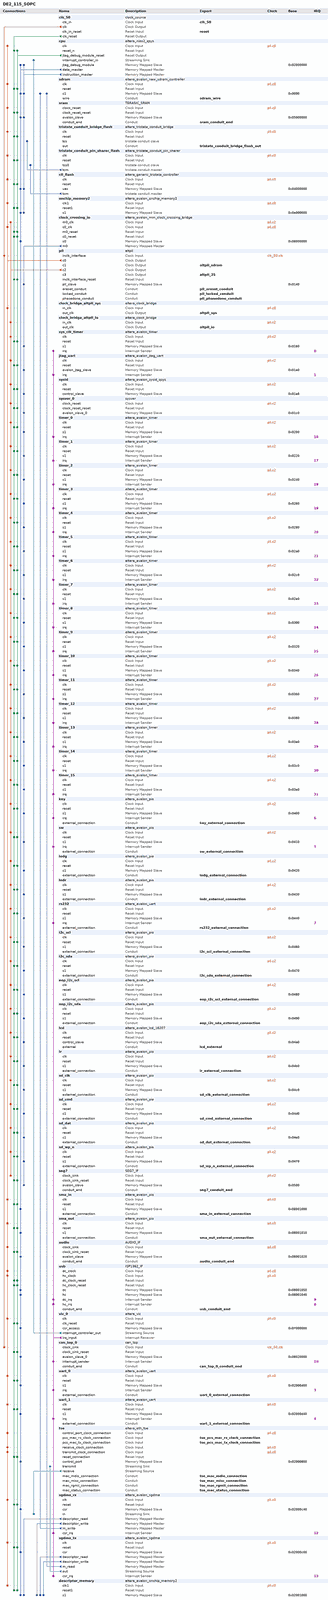
[diagram p0: system contents, whole]
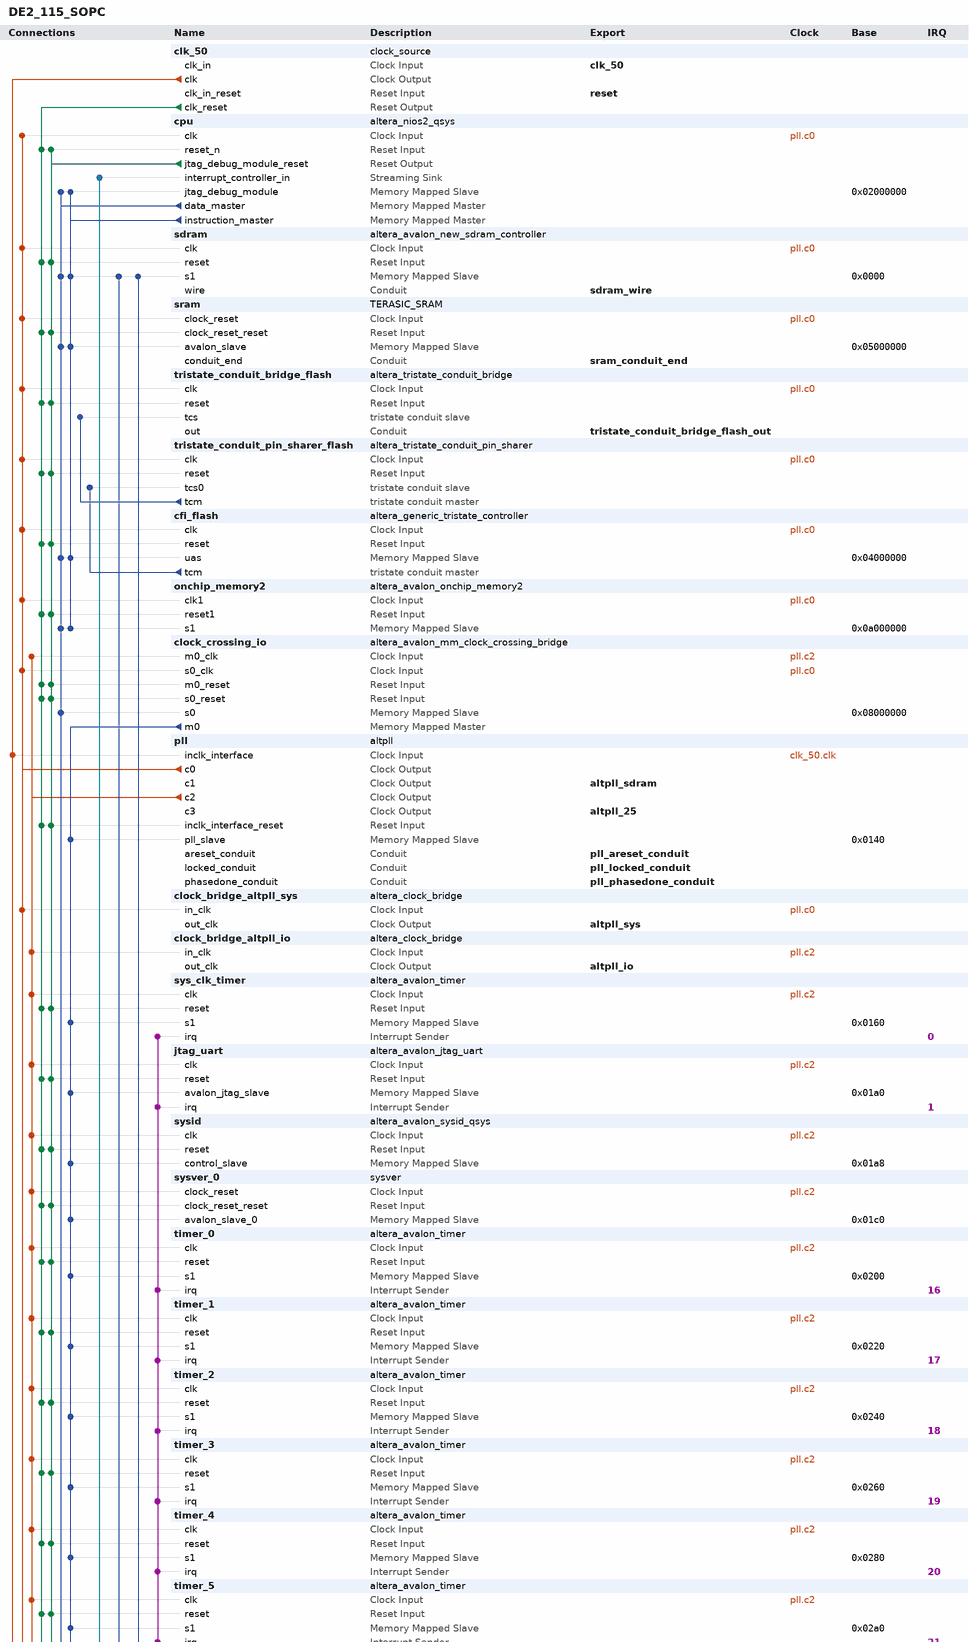
[diagram p1: system contents, upper part]
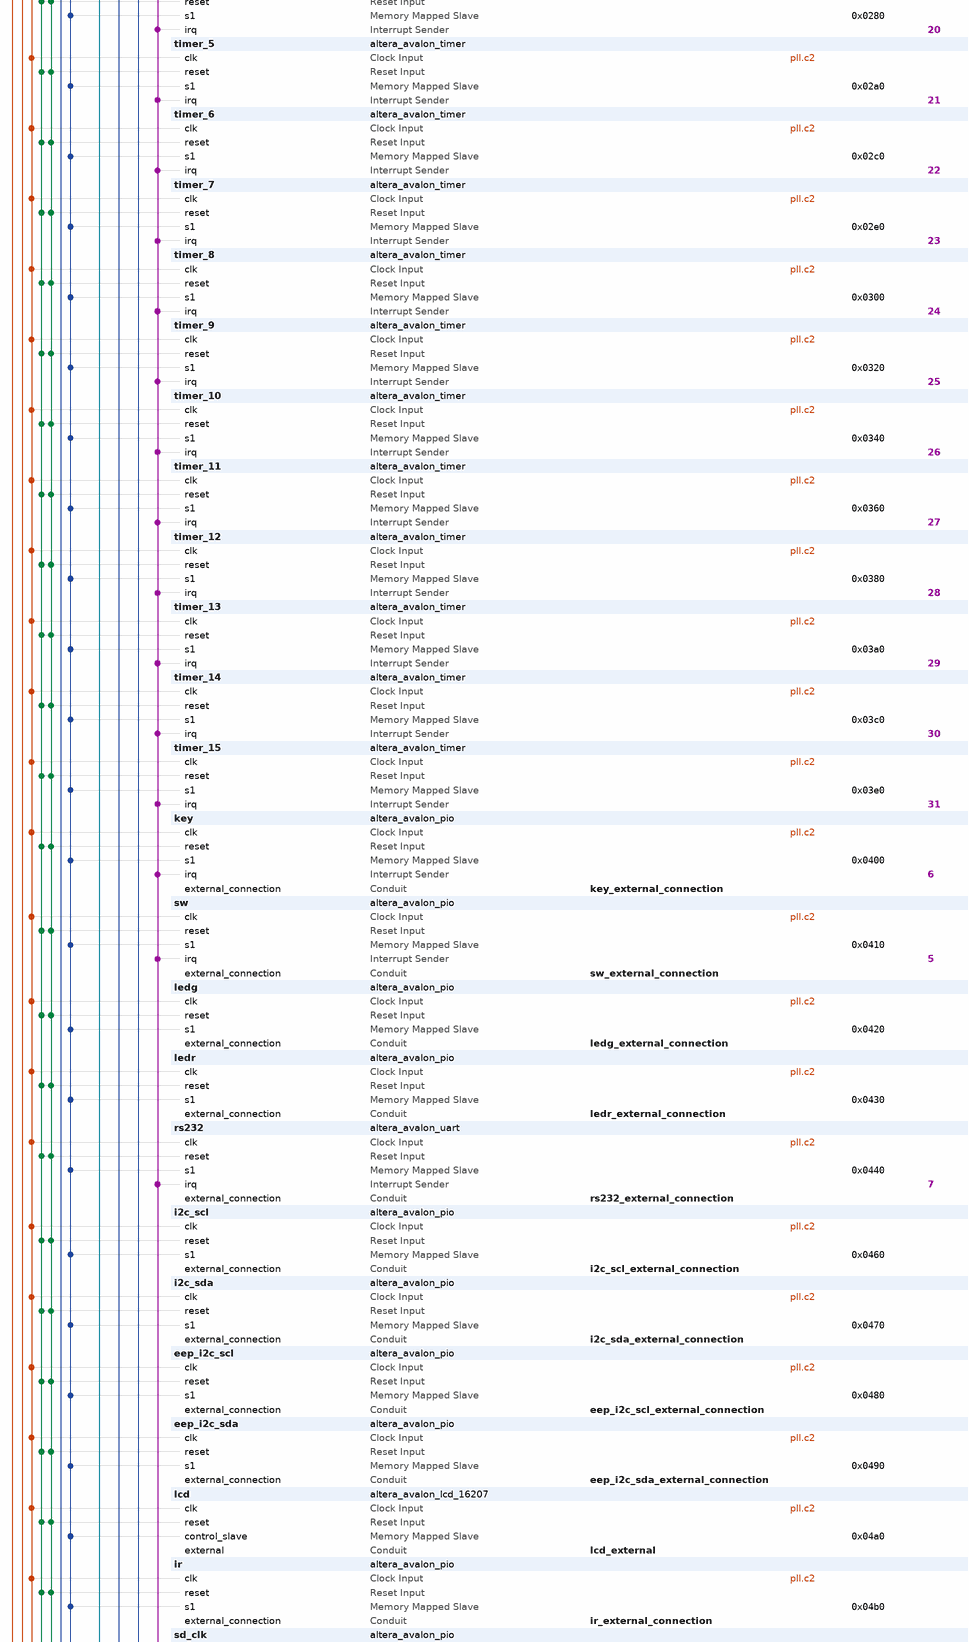
[diagram p2: system contents, middle part]
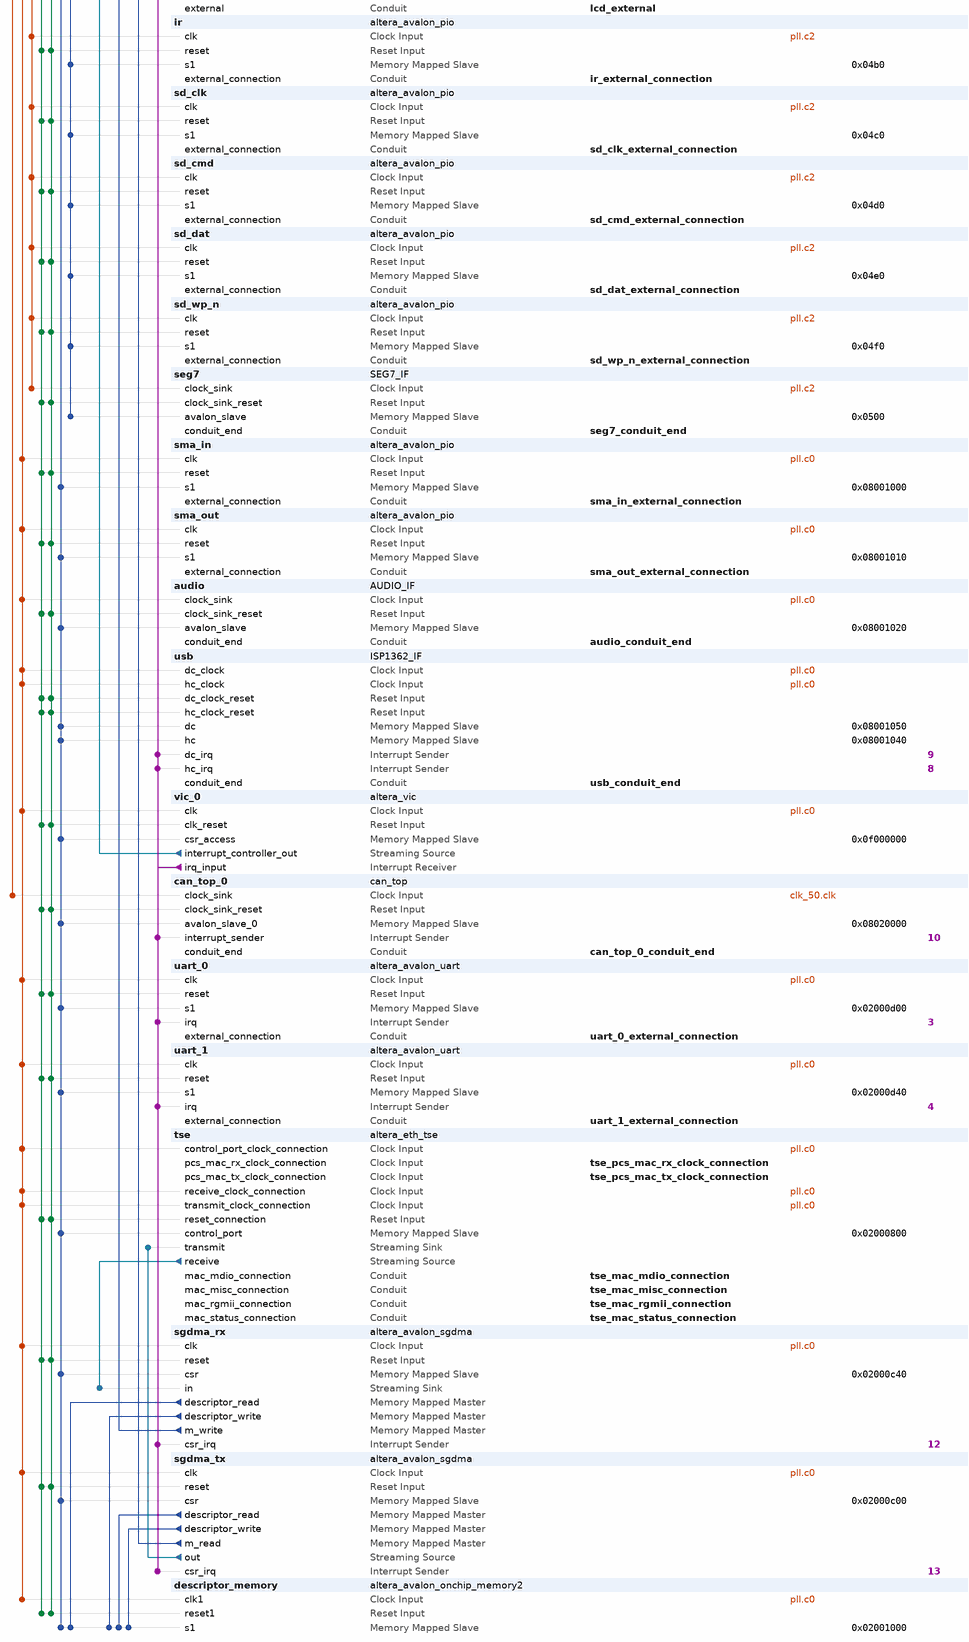
[diagram p3: system contents, lower part]
# Platform Designer (Qsys) system DE2_115_SOPC, Cyclone IV E EP4CE115F29C7
# Parameters at their usual value, and those the tool derives, are not listed.
package require -exact qsys 13.1
create_system DE2_115_SOPC
set_project_property DEVICE_FAMILY {Cyclone IV E}
set_project_property DEVICE EP4CE115F29C7

add_instance clk_50 clock_source 13.1
set_instance_parameter_value clk_50 clockFrequency 50000000

add_instance cpu altera_nios2_qsys 13.1
set_instance_parameter_value cpu setting_preciseDivisionErrorException true
set_instance_parameter_value cpu muldiv_divider true
set_instance_parameter_value cpu mpu_useLimit true
set_instance_parameter_value cpu mpu_enabled true
set_instance_parameter_value cpu manuallyAssignCpuID false
set_instance_parameter_value cpu mpu_numOfInstRegion 16
set_instance_parameter_value cpu mpu_numOfDataRegion 16
set_instance_parameter_value cpu resetSlave sram.avalon_slave
set_instance_parameter_value cpu exceptionSlave sdram.s1
set_instance_parameter_value cpu breakSlave cpu.jtag_debug_module
set_instance_parameter_value cpu setting_interruptControllerType External
set_instance_parameter_value cpu mpu_minInstRegionSize 6
set_instance_parameter_value cpu mpu_minDataRegionSize 6
set_instance_parameter_value cpu impl Fast
set_instance_parameter_value cpu icache_size 4096
set_instance_parameter_value cpu icache_burstType Sequential
set_instance_parameter_value cpu debug_level Level3
set_instance_parameter_value cpu dcache_size 0

add_instance sdram altera_avalon_new_sdram_controller 13.1
set_instance_parameter_value sdram TAC 5.5
set_instance_parameter_value sdram TRCD 20.0
set_instance_parameter_value sdram TRP 20.0
set_instance_parameter_value sdram casLatency 3
set_instance_parameter_value sdram columnWidth 10
set_instance_parameter_value sdram dataWidth 32
set_instance_parameter_value sdram generateSimulationModel true
set_instance_parameter_value sdram model custom
set_instance_parameter_value sdram numberOfBanks 4
set_instance_parameter_value sdram numberOfChipSelects 1
set_instance_parameter_value sdram powerUpDelay 100.0
set_instance_parameter_value sdram refreshPeriod 15.625
set_instance_parameter_value sdram rowWidth 11

add_instance sram TERASIC_SRAM 1.0
set_instance_parameter_value sram DATA_BITS 16
set_instance_parameter_value sram ADDR_BITS 20

add_instance tristate_conduit_bridge_flash altera_tristate_conduit_bridge 13.1

add_instance tristate_conduit_pin_sharer_flash altera_tristate_conduit_pin_sharer 13.1
set_instance_parameter_value tristate_conduit_pin_sharer_flash NUM_INTERFACES 1
set_instance_parameter_value tristate_conduit_pin_sharer_flash MODULE_ORIGIN_LIST cfi_flash.tcm,cfi_flash.tcm,cfi_flash.tcm,cfi_flash.tcm,cfi_flash.tcm
set_instance_parameter_value tristate_conduit_pin_sharer_flash SHARED_SIGNAL_LIST address_to_the_cfi_flash,read_n_to_the_cfi_flash,write_n_to_the_cfi_flash,tri_state_bridge_flash_data,select_n_to_the_cfi_flash

add_instance cfi_flash altera_generic_tristate_controller 13.1
set_instance_parameter_value cfi_flash TCM_ADDRESS_W 23
set_instance_parameter_value cfi_flash TCM_DATA_W 8
set_instance_parameter_value cfi_flash TCM_BYTEENABLE_W 1
set_instance_parameter_value cfi_flash TCM_READ_WAIT 160
set_instance_parameter_value cfi_flash TCM_WRITE_WAIT 160
set_instance_parameter_value cfi_flash TCM_SETUP_WAIT 60
set_instance_parameter_value cfi_flash TCM_DATA_HOLD 60
set_instance_parameter_value cfi_flash TCM_MAX_PENDING_READ_TRANSACTIONS 3
set_instance_parameter_value cfi_flash TCM_TURNAROUND_TIME 2
set_instance_parameter_value cfi_flash TCM_TIMING_UNITS 0
set_instance_parameter_value cfi_flash TCM_READLATENCY 2
set_instance_parameter_value cfi_flash TCM_SYMBOLS_PER_WORD 1
set_instance_parameter_value cfi_flash USE_READ 1
set_instance_parameter_value cfi_flash USE_BEGINTRANSFER 0
set_instance_parameter_value cfi_flash USE_BYTEENABLE 0
set_instance_parameter_value cfi_flash USE_OUTPUTENABLE 0
set_instance_parameter_value cfi_flash ACTIVE_LOW_READ 1
set_instance_parameter_value cfi_flash ACTIVE_LOW_BYTEENABLE 0
set_instance_parameter_value cfi_flash ACTIVE_LOW_OUTPUTENABLE 0
set_instance_parameter_value cfi_flash ACTIVE_LOW_BEGINTRANSFER 0
set_instance_parameter_value cfi_flash CHIPSELECT_THROUGH_READLATENCY 0
set_instance_parameter_value cfi_flash MODULE_ASSIGNMENT_KEYS embeddedsw.configuration.hwClassnameDriverSupportList,embeddedsw.configuration.hwClassnameDriverSupportDefault,embeddedsw.CMacro.SETUP_VALUE,embeddedsw.CMacro.WAIT_VALUE,embeddedsw.CMacro.HOLD_VALUE,embeddedsw.CMacro.TIMING_UNITS,embeddedsw.CMacro.SIZE,embeddedsw.memoryInfo.MEM_INIT_DATA_WIDTH,embeddedsw.memoryInfo.HAS_BYTE_LANE,embeddedsw.memoryInfo.IS_FLASH,embeddedsw.memoryInfo.GENERATE_DAT_SYM,embeddedsw.memoryInfo.GENERATE_FLASH,embeddedsw.memoryInfo.DAT_SYM_INSTALL_DIR,embeddedsw.memoryInfo.FLASH_INSTALL_DIR
set_instance_parameter_value cfi_flash MODULE_ASSIGNMENT_VALUES {altera_avalon_lan91c111:altera_avalon_cfi_flash,altera_avalon_cfi_flash,60,160,60,"ns",8388608u,8,0,1,1,1,SIM_DIR,APP_DIR}
set_instance_parameter_value cfi_flash INTERFACE_ASSIGNMENT_KEYS embeddedsw.configuration.isFlash,embeddedsw.configuration.isMemoryDevice,embeddedsw.configuration.isNonVolatileStorage
set_instance_parameter_value cfi_flash INTERFACE_ASSIGNMENT_VALUES 1,1,1

add_instance onchip_memory2 altera_avalon_onchip_memory2 13.1
set_instance_parameter_value onchip_memory2 dataWidth 32
set_instance_parameter_value onchip_memory2 dualPort false
set_instance_parameter_value onchip_memory2 initMemContent true
set_instance_parameter_value onchip_memory2 initializationFileName onchip_memory2
set_instance_parameter_value onchip_memory2 memorySize 131072

add_instance clock_crossing_io altera_avalon_mm_clock_crossing_bridge 13.1
set_instance_parameter_value clock_crossing_io DATA_WIDTH 32
set_instance_parameter_value clock_crossing_io ADDRESS_WIDTH 11
set_instance_parameter_value clock_crossing_io MAX_BURST_SIZE 1
set_instance_parameter_value clock_crossing_io COMMAND_FIFO_DEPTH 32
set_instance_parameter_value clock_crossing_io RESPONSE_FIFO_DEPTH 256
set_instance_parameter_value clock_crossing_io MASTER_SYNC_DEPTH 3
set_instance_parameter_value clock_crossing_io SLAVE_SYNC_DEPTH 3

add_instance pll altpll 13.1
set_instance_parameter_value pll INCLK0_INPUT_FREQUENCY 20000
set_instance_parameter_value pll CLK0_MULTIPLY_BY 2
set_instance_parameter_value pll CLK1_MULTIPLY_BY 2
set_instance_parameter_value pll CLK2_MULTIPLY_BY 6
set_instance_parameter_value pll CLK3_MULTIPLY_BY 1
set_instance_parameter_value pll CLK0_DIVIDE_BY 1
set_instance_parameter_value pll CLK1_DIVIDE_BY 1
set_instance_parameter_value pll CLK2_DIVIDE_BY 5
set_instance_parameter_value pll CLK3_DIVIDE_BY 2
set_instance_parameter_value pll CLK1_PHASE_SHIFT -1806
set_instance_parameter_value pll CLK2_PHASE_SHIFT 0
set_instance_parameter_value pll CLK3_PHASE_SHIFT 0
set_instance_parameter_value pll CLK1_DUTY_CYCLE 50
set_instance_parameter_value pll CLK2_DUTY_CYCLE 50
set_instance_parameter_value pll CLK3_DUTY_CYCLE 50
set_instance_parameter_value pll PORT_clk1 PORT_USED
set_instance_parameter_value pll PORT_clk2 PORT_USED
set_instance_parameter_value pll PORT_clk3 PORT_USED
set_instance_parameter_value pll PORT_ARESET PORT_USED
set_instance_parameter_value pll PORT_LOCKED PORT_USED

add_instance clock_bridge_altpll_sys altera_clock_bridge 13.1
set_instance_parameter_value clock_bridge_altpll_sys DERIVED_CLOCK_RATE 100000000
set_instance_parameter_value clock_bridge_altpll_sys EXPLICIT_CLOCK_RATE 0

add_instance clock_bridge_altpll_io altera_clock_bridge 13.1
set_instance_parameter_value clock_bridge_altpll_io DERIVED_CLOCK_RATE 60000000
set_instance_parameter_value clock_bridge_altpll_io EXPLICIT_CLOCK_RATE 0

add_instance sys_clk_timer altera_avalon_timer 13.1
set_instance_parameter_value sys_clk_timer period 1
set_instance_parameter_value sys_clk_timer periodUnits MSEC

add_instance jtag_uart altera_avalon_jtag_uart 13.1
set_instance_parameter_value jtag_uart simInteractiveOptions INTERACTIVE_ASCII_OUTPUT

add_instance sysid altera_avalon_sysid_qsys 13.1
set_instance_parameter_value sysid id 0

add_instance sysver_0 sysver 1.0
set_instance_parameter_value sysver_0 VER1_ROM_REG_VALUE 7
set_instance_parameter_value sysver_0 VER2_ROM_REG_VALUE 0
set_instance_parameter_value sysver_0 VER3_ROM_REG_VALUE 1
set_instance_parameter_value sysver_0 VER4_ROM_REG_VALUE 0
set_instance_parameter_value sysver_0 VER5_RAM_REG_VALUE 0
set_instance_parameter_value sysver_0 VER6_RAM_REG_VALUE 0
set_instance_parameter_value sysver_0 VER7_RAM_REG_VALUE 0
set_instance_parameter_value sysver_0 VER8_RAM_REG_VALUE 0

add_instance timer_0 altera_avalon_timer 13.1
set_instance_parameter_value timer_0 period 1
set_instance_parameter_value timer_0 periodUnits MSEC

add_instance timer_1 altera_avalon_timer 13.1
set_instance_parameter_value timer_1 period 1
set_instance_parameter_value timer_1 periodUnits MSEC

add_instance timer_2 altera_avalon_timer 13.1
set_instance_parameter_value timer_2 period 1
set_instance_parameter_value timer_2 periodUnits MSEC

add_instance timer_3 altera_avalon_timer 13.1
set_instance_parameter_value timer_3 period 1
set_instance_parameter_value timer_3 periodUnits MSEC

add_instance timer_4 altera_avalon_timer 13.1
set_instance_parameter_value timer_4 period 1
set_instance_parameter_value timer_4 periodUnits MSEC

add_instance timer_5 altera_avalon_timer 13.1
set_instance_parameter_value timer_5 period 1
set_instance_parameter_value timer_5 periodUnits MSEC

add_instance timer_6 altera_avalon_timer 13.1
set_instance_parameter_value timer_6 period 1
set_instance_parameter_value timer_6 periodUnits MSEC

add_instance timer_7 altera_avalon_timer 13.1
set_instance_parameter_value timer_7 period 1
set_instance_parameter_value timer_7 periodUnits MSEC

add_instance timer_8 altera_avalon_timer 13.1
set_instance_parameter_value timer_8 period 1
set_instance_parameter_value timer_8 periodUnits MSEC

add_instance timer_9 altera_avalon_timer 13.1
set_instance_parameter_value timer_9 period 1
set_instance_parameter_value timer_9 periodUnits MSEC

add_instance timer_10 altera_avalon_timer 13.1
set_instance_parameter_value timer_10 period 1
set_instance_parameter_value timer_10 periodUnits MSEC

add_instance timer_11 altera_avalon_timer 13.1
set_instance_parameter_value timer_11 period 1
set_instance_parameter_value timer_11 periodUnits MSEC

add_instance timer_12 altera_avalon_timer 13.1
set_instance_parameter_value timer_12 period 1
set_instance_parameter_value timer_12 periodUnits MSEC

add_instance timer_13 altera_avalon_timer 13.1
set_instance_parameter_value timer_13 period 1
set_instance_parameter_value timer_13 periodUnits MSEC

add_instance timer_14 altera_avalon_timer 13.1
set_instance_parameter_value timer_14 period 1
set_instance_parameter_value timer_14 periodUnits MSEC

add_instance timer_15 altera_avalon_timer 13.1
set_instance_parameter_value timer_15 period 1
set_instance_parameter_value timer_15 periodUnits MSEC

add_instance key altera_avalon_pio 13.1
set_instance_parameter_value key captureEdge true
set_instance_parameter_value key direction Input
set_instance_parameter_value key edgeType FALLING
set_instance_parameter_value key generateIRQ true
set_instance_parameter_value key irqType EDGE
set_instance_parameter_value key width 4

add_instance sw altera_avalon_pio 13.1
set_instance_parameter_value sw captureEdge true
set_instance_parameter_value sw direction Input
set_instance_parameter_value sw edgeType FALLING
set_instance_parameter_value sw generateIRQ true
set_instance_parameter_value sw irqType EDGE
set_instance_parameter_value sw width 18

add_instance ledg altera_avalon_pio 13.1
set_instance_parameter_value ledg direction Output
set_instance_parameter_value ledg width 9

add_instance ledr altera_avalon_pio 13.1
set_instance_parameter_value ledr direction Output
set_instance_parameter_value ledr width 18

add_instance rs232 altera_avalon_uart 13.1
set_instance_parameter_value rs232 baud 115200
set_instance_parameter_value rs232 dataBits 8
set_instance_parameter_value rs232 fixedBaud true
set_instance_parameter_value rs232 parity NONE
set_instance_parameter_value rs232 stopBits 1
set_instance_parameter_value rs232 useCtsRts true

add_instance i2c_scl altera_avalon_pio 13.1
set_instance_parameter_value i2c_scl direction Output
set_instance_parameter_value i2c_scl width 1

add_instance i2c_sda altera_avalon_pio 13.1
set_instance_parameter_value i2c_sda direction Bidir
set_instance_parameter_value i2c_sda width 1

add_instance eep_i2c_scl altera_avalon_pio 13.1
set_instance_parameter_value eep_i2c_scl direction Output
set_instance_parameter_value eep_i2c_scl width 1

add_instance eep_i2c_sda altera_avalon_pio 13.1
set_instance_parameter_value eep_i2c_sda direction Bidir
set_instance_parameter_value eep_i2c_sda width 1

add_instance lcd altera_avalon_lcd_16207 13.1

add_instance ir altera_avalon_pio 13.1
set_instance_parameter_value ir direction Input
set_instance_parameter_value ir width 1

add_instance sd_clk altera_avalon_pio 13.1
set_instance_parameter_value sd_clk direction Output
set_instance_parameter_value sd_clk width 1

add_instance sd_cmd altera_avalon_pio 13.1
set_instance_parameter_value sd_cmd direction Bidir
set_instance_parameter_value sd_cmd width 1

add_instance sd_dat altera_avalon_pio 13.1
set_instance_parameter_value sd_dat direction Bidir
set_instance_parameter_value sd_dat width 4

add_instance sd_wp_n altera_avalon_pio 13.1
set_instance_parameter_value sd_wp_n direction Input
set_instance_parameter_value sd_wp_n width 1

add_instance seg7 SEG7_IF 1.0
set_instance_parameter_value seg7 SEG7_NUM 8

add_instance sma_in altera_avalon_pio 13.1
set_instance_parameter_value sma_in direction Input
set_instance_parameter_value sma_in width 1

add_instance sma_out altera_avalon_pio 13.1
set_instance_parameter_value sma_out direction Output
set_instance_parameter_value sma_out width 1

add_instance audio AUDIO_IF 1.0

add_instance usb ISP1362_IF 1.0

add_instance vic_0 altera_vic 13.1
set_instance_parameter_value vic_0 NUMBER_OF_INT_PORTS 32
set_instance_parameter_value vic_0 RIL_WIDTH 6
set_instance_parameter_value vic_0 DAISY_CHAIN_ENABLE 0

add_instance can_top_0 can_top 2.5
set_instance_parameter_value can_top_0 Tp 1

add_instance uart_0 altera_avalon_uart 13.1
set_instance_parameter_value uart_0 baud 115200
set_instance_parameter_value uart_0 dataBits 8
set_instance_parameter_value uart_0 fixedBaud false
set_instance_parameter_value uart_0 parity NONE
set_instance_parameter_value uart_0 stopBits 1

add_instance uart_1 altera_avalon_uart 13.1
set_instance_parameter_value uart_1 baud 115200
set_instance_parameter_value uart_1 dataBits 8
set_instance_parameter_value uart_1 fixedBaud false
set_instance_parameter_value uart_1 parity NONE
set_instance_parameter_value uart_1 stopBits 1

add_instance tse altera_eth_tse 13.1
set_instance_parameter_value tse core_variation MAC_ONLY
set_instance_parameter_value tse ifGMII RGMII
set_instance_parameter_value tse transceiver_type NONE
set_instance_parameter_value tse enable_hd_logic true
set_instance_parameter_value tse stat_cnt_ena true
set_instance_parameter_value tse enable_shift16 true
set_instance_parameter_value tse enable_mac_flow_ctrl false
set_instance_parameter_value tse enable_magic_detect false
set_instance_parameter_value tse mdio_clk_div 40
set_instance_parameter_value tse ing_addr 11

add_instance sgdma_rx altera_avalon_sgdma 13.1
set_instance_parameter_value sgdma_rx enableBurstTransfers false
set_instance_parameter_value sgdma_rx enableUnalignedTransfers false
set_instance_parameter_value sgdma_rx readBlockDataWidth 32
set_instance_parameter_value sgdma_rx sinkErrorWidth 6
set_instance_parameter_value sgdma_rx sourceErrorWidth 0
set_instance_parameter_value sgdma_rx transferMode STREAM_TO_MEMORY
set_instance_parameter_value sgdma_rx writeBurstcountWidth 4

add_instance sgdma_tx altera_avalon_sgdma 13.1
set_instance_parameter_value sgdma_tx enableBurstTransfers false
set_instance_parameter_value sgdma_tx enableUnalignedTransfers false
set_instance_parameter_value sgdma_tx readBlockDataWidth 32
set_instance_parameter_value sgdma_tx sinkErrorWidth 0
set_instance_parameter_value sgdma_tx sourceErrorWidth 1
set_instance_parameter_value sgdma_tx transferMode MEMORY_TO_STREAM
set_instance_parameter_value sgdma_tx writeBurstcountWidth 4

add_instance descriptor_memory altera_avalon_onchip_memory2 13.1
set_instance_parameter_value descriptor_memory dataWidth 32
set_instance_parameter_value descriptor_memory dualPort false
set_instance_parameter_value descriptor_memory initMemContent true
set_instance_parameter_value descriptor_memory initializationFileName onchip_mem.hex
set_instance_parameter_value descriptor_memory memorySize 4096

# connections
add_connection clk_50.clk can_top_0.clock_sink clock
add_connection clk_50.clk pll.inclk_interface clock
add_connection pll.c0 audio.clock_sink clock
add_connection pll.c0 cfi_flash.clk clock
add_connection pll.c0 clock_bridge_altpll_sys.in_clk clock
add_connection pll.c0 clock_crossing_io.s0_clk clock
add_connection pll.c0 cpu.clk clock
add_connection pll.c0 descriptor_memory.clk1 clock
add_connection pll.c0 onchip_memory2.clk1 clock
add_connection pll.c0 sdram.clk clock
add_connection pll.c0 sgdma_rx.clk clock
add_connection pll.c0 sgdma_tx.clk clock
add_connection pll.c0 sma_in.clk clock
add_connection pll.c0 sma_out.clk clock
add_connection pll.c0 sram.clock_reset clock
add_connection pll.c0 tristate_conduit_bridge_flash.clk clock
add_connection pll.c0 tristate_conduit_pin_sharer_flash.clk clock
add_connection pll.c0 tse.control_port_clock_connection clock
add_connection pll.c0 tse.receive_clock_connection clock
add_connection pll.c0 tse.transmit_clock_connection clock
add_connection pll.c0 uart_0.clk clock
add_connection pll.c0 uart_1.clk clock
add_connection pll.c0 usb.dc_clock clock
add_connection pll.c0 usb.hc_clock clock
add_connection pll.c0 vic_0.clk clock
add_connection pll.c2 clock_bridge_altpll_io.in_clk clock
add_connection pll.c2 clock_crossing_io.m0_clk clock
add_connection pll.c2 eep_i2c_scl.clk clock
add_connection pll.c2 eep_i2c_sda.clk clock
add_connection pll.c2 i2c_scl.clk clock
add_connection pll.c2 i2c_sda.clk clock
add_connection pll.c2 ir.clk clock
add_connection pll.c2 jtag_uart.clk clock
add_connection pll.c2 key.clk clock
add_connection pll.c2 lcd.clk clock
add_connection pll.c2 ledg.clk clock
add_connection pll.c2 ledr.clk clock
add_connection pll.c2 rs232.clk clock
add_connection pll.c2 sd_clk.clk clock
add_connection pll.c2 sd_cmd.clk clock
add_connection pll.c2 sd_dat.clk clock
add_connection pll.c2 sd_wp_n.clk clock
add_connection pll.c2 seg7.clock_sink clock
add_connection pll.c2 sw.clk clock
add_connection pll.c2 sys_clk_timer.clk clock
add_connection pll.c2 sysid.clk clock
add_connection pll.c2 sysver_0.clock_reset clock
add_connection pll.c2 timer_0.clk clock
add_connection pll.c2 timer_1.clk clock
add_connection pll.c2 timer_2.clk clock
add_connection pll.c2 timer_3.clk clock
add_connection pll.c2 timer_4.clk clock
add_connection pll.c2 timer_5.clk clock
add_connection pll.c2 timer_6.clk clock
add_connection pll.c2 timer_7.clk clock
add_connection pll.c2 timer_8.clk clock
add_connection pll.c2 timer_9.clk clock
add_connection pll.c2 timer_10.clk clock
add_connection pll.c2 timer_11.clk clock
add_connection pll.c2 timer_12.clk clock
add_connection pll.c2 timer_13.clk clock
add_connection pll.c2 timer_14.clk clock
add_connection pll.c2 timer_15.clk clock
add_connection clk_50.clk_reset audio.clock_sink_reset reset
add_connection clk_50.clk_reset can_top_0.clock_sink_reset reset
add_connection clk_50.clk_reset cfi_flash.reset reset
add_connection clk_50.clk_reset clock_crossing_io.m0_reset reset
add_connection clk_50.clk_reset clock_crossing_io.s0_reset reset
add_connection clk_50.clk_reset cpu.reset_n reset
add_connection clk_50.clk_reset descriptor_memory.reset1 reset
add_connection clk_50.clk_reset eep_i2c_scl.reset reset
add_connection clk_50.clk_reset eep_i2c_sda.reset reset
add_connection clk_50.clk_reset i2c_scl.reset reset
add_connection clk_50.clk_reset i2c_sda.reset reset
add_connection clk_50.clk_reset ir.reset reset
add_connection clk_50.clk_reset jtag_uart.reset reset
add_connection clk_50.clk_reset key.reset reset
add_connection clk_50.clk_reset lcd.reset reset
add_connection clk_50.clk_reset ledg.reset reset
add_connection clk_50.clk_reset ledr.reset reset
add_connection clk_50.clk_reset onchip_memory2.reset1 reset
add_connection clk_50.clk_reset pll.inclk_interface_reset reset
add_connection clk_50.clk_reset rs232.reset reset
add_connection clk_50.clk_reset sd_clk.reset reset
add_connection clk_50.clk_reset sd_cmd.reset reset
add_connection clk_50.clk_reset sd_dat.reset reset
add_connection clk_50.clk_reset sd_wp_n.reset reset
add_connection clk_50.clk_reset sdram.reset reset
add_connection clk_50.clk_reset seg7.clock_sink_reset reset
add_connection clk_50.clk_reset sgdma_rx.reset reset
add_connection clk_50.clk_reset sgdma_tx.reset reset
add_connection clk_50.clk_reset sma_in.reset reset
add_connection clk_50.clk_reset sma_out.reset reset
add_connection clk_50.clk_reset sram.clock_reset_reset reset
add_connection clk_50.clk_reset sw.reset reset
add_connection clk_50.clk_reset sys_clk_timer.reset reset
add_connection clk_50.clk_reset sysid.reset reset
add_connection clk_50.clk_reset sysver_0.clock_reset_reset reset
add_connection clk_50.clk_reset timer_0.reset reset
add_connection clk_50.clk_reset timer_1.reset reset
add_connection clk_50.clk_reset timer_2.reset reset
add_connection clk_50.clk_reset timer_3.reset reset
add_connection clk_50.clk_reset timer_4.reset reset
add_connection clk_50.clk_reset timer_5.reset reset
add_connection clk_50.clk_reset timer_6.reset reset
add_connection clk_50.clk_reset timer_7.reset reset
add_connection clk_50.clk_reset timer_8.reset reset
add_connection clk_50.clk_reset timer_9.reset reset
add_connection clk_50.clk_reset timer_10.reset reset
add_connection clk_50.clk_reset timer_11.reset reset
add_connection clk_50.clk_reset timer_12.reset reset
add_connection clk_50.clk_reset timer_13.reset reset
add_connection clk_50.clk_reset timer_14.reset reset
add_connection clk_50.clk_reset timer_15.reset reset
add_connection clk_50.clk_reset tristate_conduit_bridge_flash.reset reset
add_connection clk_50.clk_reset tristate_conduit_pin_sharer_flash.reset reset
add_connection clk_50.clk_reset tse.reset_connection reset
add_connection clk_50.clk_reset uart_0.reset reset
add_connection clk_50.clk_reset uart_1.reset reset
add_connection clk_50.clk_reset usb.dc_clock_reset reset
add_connection clk_50.clk_reset usb.hc_clock_reset reset
add_connection clk_50.clk_reset vic_0.clk_reset reset
add_connection cpu.jtag_debug_module_reset audio.clock_sink_reset reset
add_connection cpu.jtag_debug_module_reset can_top_0.clock_sink_reset reset
add_connection cpu.jtag_debug_module_reset cfi_flash.reset reset
add_connection cpu.jtag_debug_module_reset clock_crossing_io.m0_reset reset
add_connection cpu.jtag_debug_module_reset clock_crossing_io.s0_reset reset
add_connection cpu.jtag_debug_module_reset cpu.reset_n reset
add_connection cpu.jtag_debug_module_reset descriptor_memory.reset1 reset
add_connection cpu.jtag_debug_module_reset eep_i2c_scl.reset reset
add_connection cpu.jtag_debug_module_reset eep_i2c_sda.reset reset
add_connection cpu.jtag_debug_module_reset i2c_scl.reset reset
add_connection cpu.jtag_debug_module_reset i2c_sda.reset reset
add_connection cpu.jtag_debug_module_reset ir.reset reset
add_connection cpu.jtag_debug_module_reset jtag_uart.reset reset
add_connection cpu.jtag_debug_module_reset key.reset reset
add_connection cpu.jtag_debug_module_reset lcd.reset reset
add_connection cpu.jtag_debug_module_reset ledg.reset reset
add_connection cpu.jtag_debug_module_reset ledr.reset reset
add_connection cpu.jtag_debug_module_reset onchip_memory2.reset1 reset
add_connection cpu.jtag_debug_module_reset pll.inclk_interface_reset reset
add_connection cpu.jtag_debug_module_reset rs232.reset reset
add_connection cpu.jtag_debug_module_reset sd_clk.reset reset
add_connection cpu.jtag_debug_module_reset sd_cmd.reset reset
add_connection cpu.jtag_debug_module_reset sd_dat.reset reset
add_connection cpu.jtag_debug_module_reset sd_wp_n.reset reset
add_connection cpu.jtag_debug_module_reset sdram.reset reset
add_connection cpu.jtag_debug_module_reset seg7.clock_sink_reset reset
add_connection cpu.jtag_debug_module_reset sgdma_rx.reset reset
add_connection cpu.jtag_debug_module_reset sgdma_tx.reset reset
add_connection cpu.jtag_debug_module_reset sma_in.reset reset
add_connection cpu.jtag_debug_module_reset sma_out.reset reset
add_connection cpu.jtag_debug_module_reset sram.clock_reset_reset reset
add_connection cpu.jtag_debug_module_reset sw.reset reset
add_connection cpu.jtag_debug_module_reset sys_clk_timer.reset reset
add_connection cpu.jtag_debug_module_reset sysid.reset reset
add_connection cpu.jtag_debug_module_reset sysver_0.clock_reset_reset reset
add_connection cpu.jtag_debug_module_reset timer_0.reset reset
add_connection cpu.jtag_debug_module_reset timer_1.reset reset
add_connection cpu.jtag_debug_module_reset timer_2.reset reset
add_connection cpu.jtag_debug_module_reset timer_3.reset reset
add_connection cpu.jtag_debug_module_reset timer_4.reset reset
add_connection cpu.jtag_debug_module_reset timer_5.reset reset
add_connection cpu.jtag_debug_module_reset timer_6.reset reset
add_connection cpu.jtag_debug_module_reset timer_7.reset reset
add_connection cpu.jtag_debug_module_reset timer_8.reset reset
add_connection cpu.jtag_debug_module_reset timer_9.reset reset
add_connection cpu.jtag_debug_module_reset timer_10.reset reset
add_connection cpu.jtag_debug_module_reset timer_11.reset reset
add_connection cpu.jtag_debug_module_reset timer_12.reset reset
add_connection cpu.jtag_debug_module_reset timer_13.reset reset
add_connection cpu.jtag_debug_module_reset timer_14.reset reset
add_connection cpu.jtag_debug_module_reset timer_15.reset reset
add_connection cpu.jtag_debug_module_reset tristate_conduit_bridge_flash.reset reset
add_connection cpu.jtag_debug_module_reset tristate_conduit_pin_sharer_flash.reset reset
add_connection cpu.jtag_debug_module_reset tse.reset_connection reset
add_connection cpu.jtag_debug_module_reset uart_0.reset reset
add_connection cpu.jtag_debug_module_reset uart_1.reset reset
add_connection cpu.jtag_debug_module_reset usb.dc_clock_reset reset
add_connection cpu.jtag_debug_module_reset usb.hc_clock_reset reset
add_connection cpu.jtag_debug_module_reset vic_0.clk_reset reset
add_connection clock_crossing_io.m0 eep_i2c_scl.s1 avalon
set_connection_parameter_value clock_crossing_io.m0/eep_i2c_scl.s1 baseAddress 0x0480
add_connection clock_crossing_io.m0 eep_i2c_sda.s1 avalon
set_connection_parameter_value clock_crossing_io.m0/eep_i2c_sda.s1 baseAddress 0x0490
add_connection clock_crossing_io.m0 i2c_scl.s1 avalon
set_connection_parameter_value clock_crossing_io.m0/i2c_scl.s1 baseAddress 0x0460
add_connection clock_crossing_io.m0 i2c_sda.s1 avalon
set_connection_parameter_value clock_crossing_io.m0/i2c_sda.s1 baseAddress 0x0470
add_connection clock_crossing_io.m0 ir.s1 avalon
set_connection_parameter_value clock_crossing_io.m0/ir.s1 baseAddress 0x04b0
add_connection clock_crossing_io.m0 jtag_uart.avalon_jtag_slave avalon
set_connection_parameter_value clock_crossing_io.m0/jtag_uart.avalon_jtag_slave baseAddress 0x01a0
add_connection clock_crossing_io.m0 key.s1 avalon
set_connection_parameter_value clock_crossing_io.m0/key.s1 baseAddress 0x0400
add_connection clock_crossing_io.m0 lcd.control_slave avalon
set_connection_parameter_value clock_crossing_io.m0/lcd.control_slave baseAddress 0x04a0
add_connection clock_crossing_io.m0 ledg.s1 avalon
set_connection_parameter_value clock_crossing_io.m0/ledg.s1 baseAddress 0x0420
add_connection clock_crossing_io.m0 ledr.s1 avalon
set_connection_parameter_value clock_crossing_io.m0/ledr.s1 baseAddress 0x0430
add_connection clock_crossing_io.m0 pll.pll_slave avalon
set_connection_parameter_value clock_crossing_io.m0/pll.pll_slave baseAddress 0x0140
add_connection clock_crossing_io.m0 rs232.s1 avalon
set_connection_parameter_value clock_crossing_io.m0/rs232.s1 baseAddress 0x0440
add_connection clock_crossing_io.m0 sd_clk.s1 avalon
set_connection_parameter_value clock_crossing_io.m0/sd_clk.s1 baseAddress 0x04c0
add_connection clock_crossing_io.m0 sd_cmd.s1 avalon
set_connection_parameter_value clock_crossing_io.m0/sd_cmd.s1 baseAddress 0x04d0
add_connection clock_crossing_io.m0 sd_dat.s1 avalon
set_connection_parameter_value clock_crossing_io.m0/sd_dat.s1 baseAddress 0x04e0
add_connection clock_crossing_io.m0 sd_wp_n.s1 avalon
set_connection_parameter_value clock_crossing_io.m0/sd_wp_n.s1 baseAddress 0x04f0
add_connection clock_crossing_io.m0 seg7.avalon_slave avalon
set_connection_parameter_value clock_crossing_io.m0/seg7.avalon_slave baseAddress 0x0500
add_connection clock_crossing_io.m0 sw.s1 avalon
set_connection_parameter_value clock_crossing_io.m0/sw.s1 baseAddress 0x0410
add_connection clock_crossing_io.m0 sys_clk_timer.s1 avalon
set_connection_parameter_value clock_crossing_io.m0/sys_clk_timer.s1 baseAddress 0x0160
add_connection clock_crossing_io.m0 sysid.control_slave avalon
set_connection_parameter_value clock_crossing_io.m0/sysid.control_slave baseAddress 0x01a8
add_connection clock_crossing_io.m0 sysver_0.avalon_slave_0 avalon
set_connection_parameter_value clock_crossing_io.m0/sysver_0.avalon_slave_0 baseAddress 0x01c0
add_connection clock_crossing_io.m0 timer_0.s1 avalon
set_connection_parameter_value clock_crossing_io.m0/timer_0.s1 baseAddress 0x0200
add_connection clock_crossing_io.m0 timer_1.s1 avalon
set_connection_parameter_value clock_crossing_io.m0/timer_1.s1 baseAddress 0x0220
add_connection clock_crossing_io.m0 timer_2.s1 avalon
set_connection_parameter_value clock_crossing_io.m0/timer_2.s1 baseAddress 0x0240
add_connection clock_crossing_io.m0 timer_3.s1 avalon
set_connection_parameter_value clock_crossing_io.m0/timer_3.s1 baseAddress 0x0260
add_connection clock_crossing_io.m0 timer_4.s1 avalon
set_connection_parameter_value clock_crossing_io.m0/timer_4.s1 baseAddress 0x0280
add_connection clock_crossing_io.m0 timer_5.s1 avalon
set_connection_parameter_value clock_crossing_io.m0/timer_5.s1 baseAddress 0x02a0
add_connection clock_crossing_io.m0 timer_6.s1 avalon
set_connection_parameter_value clock_crossing_io.m0/timer_6.s1 baseAddress 0x02c0
add_connection clock_crossing_io.m0 timer_7.s1 avalon
set_connection_parameter_value clock_crossing_io.m0/timer_7.s1 baseAddress 0x02e0
add_connection clock_crossing_io.m0 timer_8.s1 avalon
set_connection_parameter_value clock_crossing_io.m0/timer_8.s1 baseAddress 0x0300
add_connection clock_crossing_io.m0 timer_9.s1 avalon
set_connection_parameter_value clock_crossing_io.m0/timer_9.s1 baseAddress 0x0320
add_connection clock_crossing_io.m0 timer_10.s1 avalon
set_connection_parameter_value clock_crossing_io.m0/timer_10.s1 baseAddress 0x0340
add_connection clock_crossing_io.m0 timer_11.s1 avalon
set_connection_parameter_value clock_crossing_io.m0/timer_11.s1 baseAddress 0x0360
add_connection clock_crossing_io.m0 timer_12.s1 avalon
set_connection_parameter_value clock_crossing_io.m0/timer_12.s1 baseAddress 0x0380
add_connection clock_crossing_io.m0 timer_13.s1 avalon
set_connection_parameter_value clock_crossing_io.m0/timer_13.s1 baseAddress 0x03a0
add_connection clock_crossing_io.m0 timer_14.s1 avalon
set_connection_parameter_value clock_crossing_io.m0/timer_14.s1 baseAddress 0x03c0
add_connection clock_crossing_io.m0 timer_15.s1 avalon
set_connection_parameter_value clock_crossing_io.m0/timer_15.s1 baseAddress 0x03e0
add_connection cpu.data_master audio.avalon_slave avalon
set_connection_parameter_value cpu.data_master/audio.avalon_slave baseAddress 0x08001020
add_connection cpu.data_master can_top_0.avalon_slave_0 avalon
set_connection_parameter_value cpu.data_master/can_top_0.avalon_slave_0 baseAddress 0x08020000
add_connection cpu.data_master cfi_flash.uas avalon
set_connection_parameter_value cpu.data_master/cfi_flash.uas baseAddress 0x04000000
add_connection cpu.data_master clock_crossing_io.s0 avalon
set_connection_parameter_value cpu.data_master/clock_crossing_io.s0 baseAddress 0x08000000
add_connection cpu.data_master cpu.jtag_debug_module avalon
set_connection_parameter_value cpu.data_master/cpu.jtag_debug_module baseAddress 0x02000000
add_connection cpu.data_master descriptor_memory.s1 avalon
set_connection_parameter_value cpu.data_master/descriptor_memory.s1 baseAddress 0x02001000
add_connection cpu.data_master onchip_memory2.s1 avalon
set_connection_parameter_value cpu.data_master/onchip_memory2.s1 baseAddress 0x0a000000
add_connection cpu.data_master sdram.s1 avalon
set_connection_parameter_value cpu.data_master/sdram.s1 baseAddress 0x0000
add_connection cpu.data_master sgdma_rx.csr avalon
set_connection_parameter_value cpu.data_master/sgdma_rx.csr baseAddress 0x02000c40
add_connection cpu.data_master sgdma_tx.csr avalon
set_connection_parameter_value cpu.data_master/sgdma_tx.csr baseAddress 0x02000c00
add_connection cpu.data_master sma_in.s1 avalon
set_connection_parameter_value cpu.data_master/sma_in.s1 baseAddress 0x08001000
add_connection cpu.data_master sma_out.s1 avalon
set_connection_parameter_value cpu.data_master/sma_out.s1 baseAddress 0x08001010
add_connection cpu.data_master sram.avalon_slave avalon
set_connection_parameter_value cpu.data_master/sram.avalon_slave baseAddress 0x05000000
add_connection cpu.data_master tse.control_port avalon
set_connection_parameter_value cpu.data_master/tse.control_port baseAddress 0x02000800
add_connection cpu.data_master uart_0.s1 avalon
set_connection_parameter_value cpu.data_master/uart_0.s1 baseAddress 0x02000d00
add_connection cpu.data_master uart_1.s1 avalon
set_connection_parameter_value cpu.data_master/uart_1.s1 baseAddress 0x02000d40
add_connection cpu.data_master usb.dc avalon
set_connection_parameter_value cpu.data_master/usb.dc baseAddress 0x08001050
add_connection cpu.data_master usb.hc avalon
set_connection_parameter_value cpu.data_master/usb.hc baseAddress 0x08001040
add_connection cpu.data_master vic_0.csr_access avalon
set_connection_parameter_value cpu.data_master/vic_0.csr_access baseAddress 0x0f000000
add_connection cpu.instruction_master cfi_flash.uas avalon
set_connection_parameter_value cpu.instruction_master/cfi_flash.uas baseAddress 0x04000000
add_connection cpu.instruction_master cpu.jtag_debug_module avalon
set_connection_parameter_value cpu.instruction_master/cpu.jtag_debug_module baseAddress 0x02000000
add_connection cpu.instruction_master onchip_memory2.s1 avalon
set_connection_parameter_value cpu.instruction_master/onchip_memory2.s1 baseAddress 0x0a000000
add_connection cpu.instruction_master sdram.s1 avalon
set_connection_parameter_value cpu.instruction_master/sdram.s1 baseAddress 0x0000
add_connection cpu.instruction_master sram.avalon_slave avalon
set_connection_parameter_value cpu.instruction_master/sram.avalon_slave baseAddress 0x05000000
add_connection sgdma_rx.descriptor_read descriptor_memory.s1 avalon
set_connection_parameter_value sgdma_rx.descriptor_read/descriptor_memory.s1 baseAddress 0x02001000
add_connection sgdma_rx.descriptor_write descriptor_memory.s1 avalon
set_connection_parameter_value sgdma_rx.descriptor_write/descriptor_memory.s1 baseAddress 0x02001000
add_connection sgdma_rx.m_write sdram.s1 avalon
set_connection_parameter_value sgdma_rx.m_write/sdram.s1 baseAddress 0x0000
add_connection sgdma_tx.descriptor_read descriptor_memory.s1 avalon
set_connection_parameter_value sgdma_tx.descriptor_read/descriptor_memory.s1 baseAddress 0x02001000
add_connection sgdma_tx.descriptor_write descriptor_memory.s1 avalon
set_connection_parameter_value sgdma_tx.descriptor_write/descriptor_memory.s1 baseAddress 0x02001000
add_connection sgdma_tx.m_read sdram.s1 avalon
set_connection_parameter_value sgdma_tx.m_read/sdram.s1 baseAddress 0x0000
add_connection sgdma_tx.out tse.transmit avalon_streaming
add_connection tse.receive sgdma_rx.in avalon_streaming
add_connection vic_0.interrupt_controller_out cpu.interrupt_controller_in avalon_streaming
add_connection vic_0.irq_input can_top_0.interrupt_sender interrupt
set_connection_parameter_value vic_0.irq_input/can_top_0.interrupt_sender irqNumber 10
add_connection vic_0.irq_input jtag_uart.irq interrupt
set_connection_parameter_value vic_0.irq_input/jtag_uart.irq irqNumber 1
add_connection vic_0.irq_input key.irq interrupt
set_connection_parameter_value vic_0.irq_input/key.irq irqNumber 6
add_connection vic_0.irq_input rs232.irq interrupt
set_connection_parameter_value vic_0.irq_input/rs232.irq irqNumber 7
add_connection vic_0.irq_input sgdma_rx.csr_irq interrupt
set_connection_parameter_value vic_0.irq_input/sgdma_rx.csr_irq irqNumber 12
add_connection vic_0.irq_input sgdma_tx.csr_irq interrupt
set_connection_parameter_value vic_0.irq_input/sgdma_tx.csr_irq irqNumber 13
add_connection vic_0.irq_input sw.irq interrupt
set_connection_parameter_value vic_0.irq_input/sw.irq irqNumber 5
add_connection vic_0.irq_input sys_clk_timer.irq interrupt
set_connection_parameter_value vic_0.irq_input/sys_clk_timer.irq irqNumber 0
add_connection vic_0.irq_input timer_0.irq interrupt
set_connection_parameter_value vic_0.irq_input/timer_0.irq irqNumber 16
add_connection vic_0.irq_input timer_1.irq interrupt
set_connection_parameter_value vic_0.irq_input/timer_1.irq irqNumber 17
add_connection vic_0.irq_input timer_2.irq interrupt
set_connection_parameter_value vic_0.irq_input/timer_2.irq irqNumber 18
add_connection vic_0.irq_input timer_3.irq interrupt
set_connection_parameter_value vic_0.irq_input/timer_3.irq irqNumber 19
add_connection vic_0.irq_input timer_4.irq interrupt
set_connection_parameter_value vic_0.irq_input/timer_4.irq irqNumber 20
add_connection vic_0.irq_input timer_5.irq interrupt
set_connection_parameter_value vic_0.irq_input/timer_5.irq irqNumber 21
add_connection vic_0.irq_input timer_6.irq interrupt
set_connection_parameter_value vic_0.irq_input/timer_6.irq irqNumber 22
add_connection vic_0.irq_input timer_7.irq interrupt
set_connection_parameter_value vic_0.irq_input/timer_7.irq irqNumber 23
add_connection vic_0.irq_input timer_8.irq interrupt
set_connection_parameter_value vic_0.irq_input/timer_8.irq irqNumber 24
add_connection vic_0.irq_input timer_9.irq interrupt
set_connection_parameter_value vic_0.irq_input/timer_9.irq irqNumber 25
add_connection vic_0.irq_input timer_10.irq interrupt
set_connection_parameter_value vic_0.irq_input/timer_10.irq irqNumber 26
add_connection vic_0.irq_input timer_11.irq interrupt
set_connection_parameter_value vic_0.irq_input/timer_11.irq irqNumber 27
add_connection vic_0.irq_input timer_12.irq interrupt
set_connection_parameter_value vic_0.irq_input/timer_12.irq irqNumber 28
add_connection vic_0.irq_input timer_13.irq interrupt
set_connection_parameter_value vic_0.irq_input/timer_13.irq irqNumber 29
add_connection vic_0.irq_input timer_14.irq interrupt
set_connection_parameter_value vic_0.irq_input/timer_14.irq irqNumber 30
add_connection vic_0.irq_input timer_15.irq interrupt
set_connection_parameter_value vic_0.irq_input/timer_15.irq irqNumber 31
add_connection vic_0.irq_input uart_0.irq interrupt
set_connection_parameter_value vic_0.irq_input/uart_0.irq irqNumber 3
add_connection vic_0.irq_input uart_1.irq interrupt
set_connection_parameter_value vic_0.irq_input/uart_1.irq irqNumber 4
add_connection vic_0.irq_input usb.dc_irq interrupt
set_connection_parameter_value vic_0.irq_input/usb.dc_irq irqNumber 9
add_connection vic_0.irq_input usb.hc_irq interrupt
set_connection_parameter_value vic_0.irq_input/usb.hc_irq irqNumber 8
add_connection cfi_flash.tcm tristate_conduit_pin_sharer_flash.tcs0 tristate_conduit
add_connection tristate_conduit_pin_sharer_flash.tcm tristate_conduit_bridge_flash.tcs tristate_conduit

# exported interfaces
add_interface clk_50 clock sink
set_interface_property clk_50 EXPORT_OF clk_50.clk_in
add_interface reset reset sink
set_interface_property reset EXPORT_OF clk_50.clk_in_reset
add_interface sdram_wire conduit end
set_interface_property sdram_wire EXPORT_OF sdram.wire
add_interface sram_conduit_end conduit end
set_interface_property sram_conduit_end EXPORT_OF sram.conduit_end
add_interface tristate_conduit_bridge_flash_out conduit end
set_interface_property tristate_conduit_bridge_flash_out EXPORT_OF tristate_conduit_bridge_flash.out
add_interface altpll_sdram clock source
set_interface_property altpll_sdram EXPORT_OF pll.c1
add_interface altpll_25 clock source
set_interface_property altpll_25 EXPORT_OF pll.c3
add_interface pll_areset_conduit conduit end
set_interface_property pll_areset_conduit EXPORT_OF pll.areset_conduit
add_interface pll_locked_conduit conduit end
set_interface_property pll_locked_conduit EXPORT_OF pll.locked_conduit
add_interface pll_phasedone_conduit conduit end
set_interface_property pll_phasedone_conduit EXPORT_OF pll.phasedone_conduit
add_interface altpll_sys clock source
set_interface_property altpll_sys EXPORT_OF clock_bridge_altpll_sys.out_clk
add_interface altpll_io clock source
set_interface_property altpll_io EXPORT_OF clock_bridge_altpll_io.out_clk
add_interface key_external_connection conduit end
set_interface_property key_external_connection EXPORT_OF key.external_connection
add_interface sw_external_connection conduit end
set_interface_property sw_external_connection EXPORT_OF sw.external_connection
add_interface ledg_external_connection conduit end
set_interface_property ledg_external_connection EXPORT_OF ledg.external_connection
add_interface ledr_external_connection conduit end
set_interface_property ledr_external_connection EXPORT_OF ledr.external_connection
add_interface rs232_external_connection conduit end
set_interface_property rs232_external_connection EXPORT_OF rs232.external_connection
add_interface i2c_scl_external_connection conduit end
set_interface_property i2c_scl_external_connection EXPORT_OF i2c_scl.external_connection
add_interface i2c_sda_external_connection conduit end
set_interface_property i2c_sda_external_connection EXPORT_OF i2c_sda.external_connection
add_interface eep_i2c_scl_external_connection conduit end
set_interface_property eep_i2c_scl_external_connection EXPORT_OF eep_i2c_scl.external_connection
add_interface eep_i2c_sda_external_connection conduit end
set_interface_property eep_i2c_sda_external_connection EXPORT_OF eep_i2c_sda.external_connection
add_interface lcd_external conduit end
set_interface_property lcd_external EXPORT_OF lcd.external
add_interface ir_external_connection conduit end
set_interface_property ir_external_connection EXPORT_OF ir.external_connection
add_interface sd_clk_external_connection conduit end
set_interface_property sd_clk_external_connection EXPORT_OF sd_clk.external_connection
add_interface sd_cmd_external_connection conduit end
set_interface_property sd_cmd_external_connection EXPORT_OF sd_cmd.external_connection
add_interface sd_dat_external_connection conduit end
set_interface_property sd_dat_external_connection EXPORT_OF sd_dat.external_connection
add_interface sd_wp_n_external_connection conduit end
set_interface_property sd_wp_n_external_connection EXPORT_OF sd_wp_n.external_connection
add_interface seg7_conduit_end conduit end
set_interface_property seg7_conduit_end EXPORT_OF seg7.conduit_end
add_interface sma_in_external_connection conduit end
set_interface_property sma_in_external_connection EXPORT_OF sma_in.external_connection
add_interface sma_out_external_connection conduit end
set_interface_property sma_out_external_connection EXPORT_OF sma_out.external_connection
add_interface audio_conduit_end conduit end
set_interface_property audio_conduit_end EXPORT_OF audio.conduit_end
add_interface usb_conduit_end conduit end
set_interface_property usb_conduit_end EXPORT_OF usb.conduit_end
add_interface can_top_0_conduit_end conduit end
set_interface_property can_top_0_conduit_end EXPORT_OF can_top_0.conduit_end
add_interface uart_0_external_connection conduit end
set_interface_property uart_0_external_connection EXPORT_OF uart_0.external_connection
add_interface uart_1_external_connection conduit end
set_interface_property uart_1_external_connection EXPORT_OF uart_1.external_connection
add_interface tse_pcs_mac_tx_clock_connection clock sink
set_interface_property tse_pcs_mac_tx_clock_connection EXPORT_OF tse.pcs_mac_tx_clock_connection
add_interface tse_pcs_mac_rx_clock_connection clock sink
set_interface_property tse_pcs_mac_rx_clock_connection EXPORT_OF tse.pcs_mac_rx_clock_connection
add_interface tse_mac_status_connection conduit end
set_interface_property tse_mac_status_connection EXPORT_OF tse.mac_status_connection
add_interface tse_mac_rgmii_connection conduit end
set_interface_property tse_mac_rgmii_connection EXPORT_OF tse.mac_rgmii_connection
add_interface tse_mac_mdio_connection conduit end
set_interface_property tse_mac_mdio_connection EXPORT_OF tse.mac_mdio_connection
add_interface tse_mac_misc_connection conduit end
set_interface_property tse_mac_misc_connection EXPORT_OF tse.mac_misc_connection

set_interconnect_requirement {$system} qsys_mm.clockCrossingAdapter HANDSHAKE
set_interconnect_requirement {$system} qsys_mm.maxAdditionalLatency 0

save_system DE2_115_SOPC.qsys
